# Altium schematic sheet optics.SchDoc
size A4
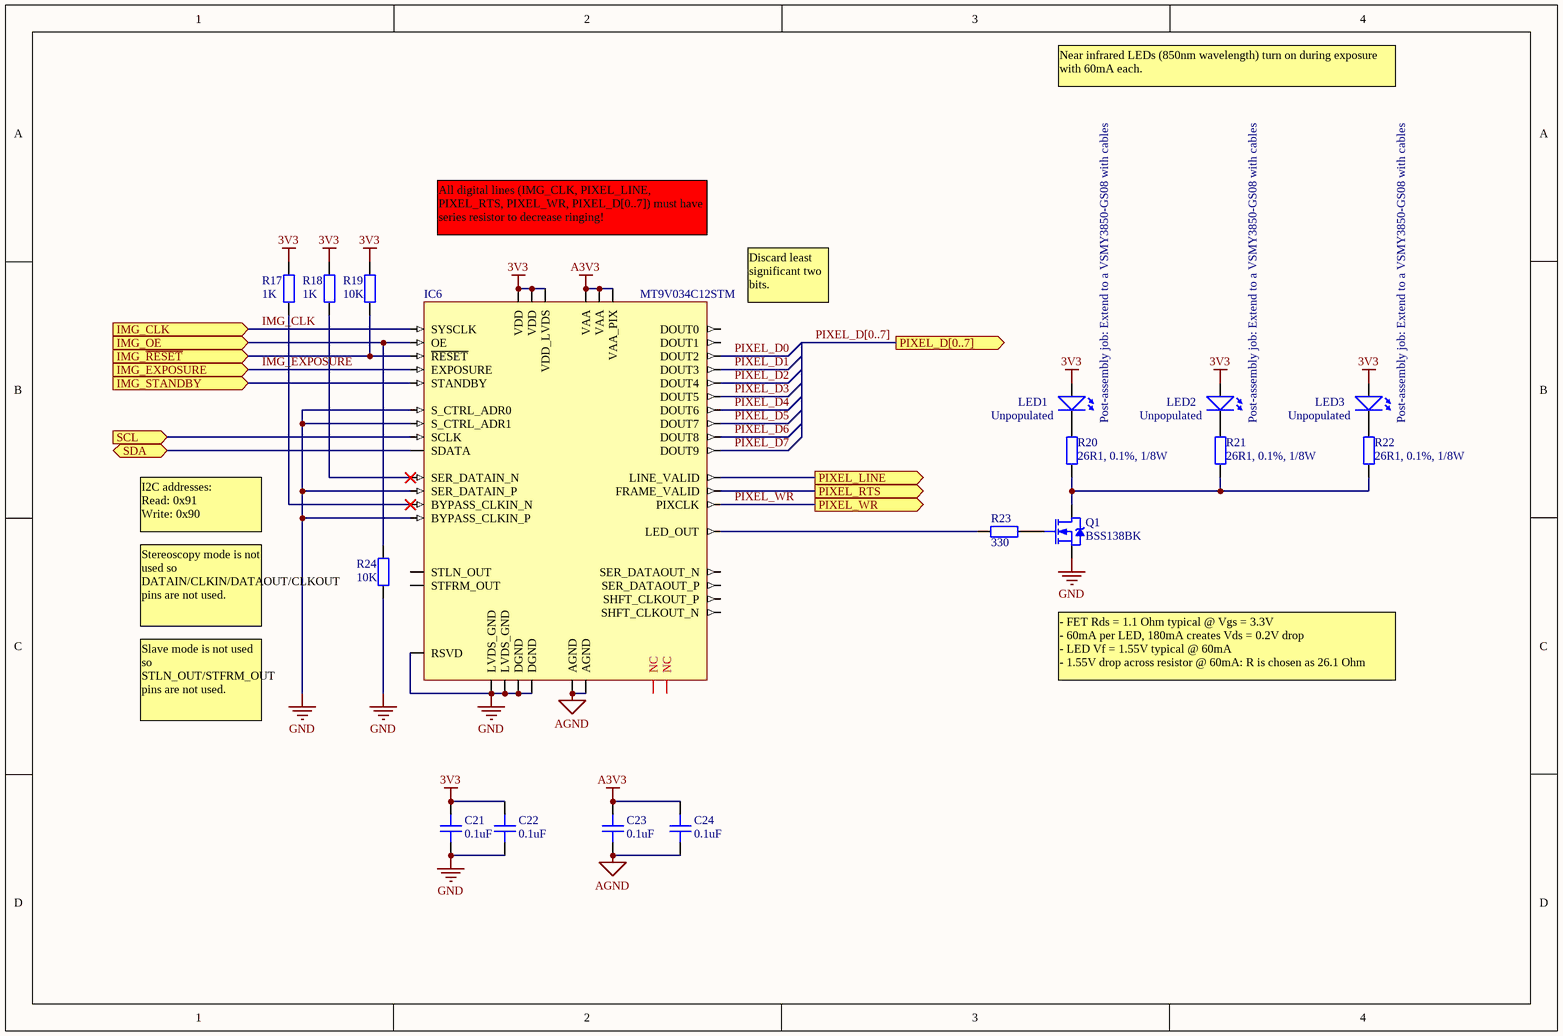
[diagram p0: optics.SchDoc]

## Parts
C21  0.1uF  [1608[0603]_M]
C22  0.1uF  [1608[0603]_M]
C23  0.1uF  [1608[0603]_M]
C24  0.1uF  [1608[0603]_M]
IC6  MT9V034C12STM  [CLCC-48_m]
LED1  Unpopulated  Post-assembly job: Extend to a VSMY3850-GS08 with cables  [PLCC2_WITH_HEATSINK]
LED2  Unpopulated  Post-assembly job: Extend to a VSMY3850-GS08 with cables  [PLCC2_WITH_HEATSINK]
LED3  Unpopulated  Post-assembly job: Extend to a VSMY3850-GS08 with cables  [PLCC2_WITH_HEATSINK]
Q1  BSS138BK  [SOT23-3_N]
R17  1K  [1608[0603]_M]
R18  1K  [1608[0603]_M]
R19  10K  [1608[0603]_M]
R20  26R1, 0.1%, 1/8W  [2012[0805]_M]
R21  26R1, 0.1%, 1/8W  [2012[0805]_M]
R22  26R1, 0.1%, 1/8W  [2012[0805]_M]
R23  330  [1608[0603]_M]
R24  10K  [1608[0603]_M]

## Ports
IMG_CLK (in), IMG_EXPOSURE (in), IMG_OE (in), IMG_STANDBY (in), IMG_~{RESET} (in), PIXEL_D[0..7] (out), PIXEL_LINE (out), PIXEL_RTS (out), PIXEL_WR (out), SCL (in), SDA (bidir)

## Nets
3V3: C21.2 C22.2 IC6.1(VDD) IC6.6(VDD_LVDS) IC6.14(VDD) LED1.A LED2.A LED3.A R17.2 R18.2 R19.2
A3V3: C23.2 C24.2 IC6.35(VAA) IC6.39(VAA) IC6.40(VAA_PIX)
AGND: C23.1 C24.1 IC6.34(AGND) IC6.38(AGND)
GND: C21.1 C22.1 IC6.7(LVDS_GND) IC6.9(BYPASS_CLKIN_P) IC6.11(SER_DATAIN_P) IC6.12(LVDS_GND) IC6.13(DGND) IC6.29(RSVD) IC6.30(S_CTRL_ADR0) IC6.31(S_CTRL_ADR1) IC6.48(DGND) Q1.S R24.1
IMG_CLK: IC6.47(SYSCLK) ; port IMG_CLK
IMG_EXPOSURE: IC6.23(EXPOSURE) ; port IMG_EXPOSURE
IMG_OE: IC6.28(OE) R24.2 ; port IMG_OE
IMG_~{RESET}: IC6.32(~{RESET}) R19.1 ; port IMG_~{RESET}
IMG_STANDBY: IC6.33(STANDBY) ; port IMG_STANDBY
PIXEL_D0: IC6.43(DOUT2)
PIXEL_D1: IC6.42(DOUT3)
PIXEL_D2: IC6.41(DOUT4)
PIXEL_D3: IC6.15(DOUT5)
PIXEL_D4: IC6.16(DOUT6)
PIXEL_D5: IC6.17(DOUT7)
PIXEL_D6: IC6.18(DOUT8)
PIXEL_D7: IC6.19(DOUT9)
PIXEL_LINE: IC6.20(LINE_VALID) ; port PIXEL_LINE
PIXEL_RTS: IC6.21(FRAME_VALID) ; port PIXEL_RTS
PIXEL_WR: IC6.46(PIXCLK) ; port PIXEL_WR
SCL: IC6.25(SCLK) ; port SCL
SDA: IC6.24(SDATA) ; port SDA
NetIC6_8: IC6.8(BYPASS_CLKIN_N) R17.1
NetIC6_10: IC6.10(SER_DATAIN_N) R18.1
NetIC6_27: IC6.27(LED_OUT) R23.1
NetLED1_K: LED1.K R20.2
NetLED2_K: LED2.K R21.2
NetLED3_K: LED3.K R22.2
NetQ1_D: Q1.D R20.1 R21.1 R22.1
NetQ1_G: Q1.G R23.2

Not connected (* = marked no-connect by the designer): IC6 2(SHFT_CLKOUT_N) 3(SHFT_CLKOUT_P) 4(SER_DATAOUT_P) 5(SER_DATAOUT_N) 22(STLN_OUT) 26(STFRM_OUT) 36(NC) 37(NC) 44(DOUT1) 45(DOUT0)

## Buses and harness runs
bus PIXEL_D[0..7] = port PIXEL_D[0..7]

## Notes on the sheet
- Near infrared LEDs (850nm wavelength) turn on during exposure with 60mA each.
- All digital lines (IMG_CLK, PIXEL_LINE, PIXEL_RTS, PIXEL_WR, PIXEL_D[0..7]) must have series resistor to decrease ringing!
- (near IC6) Discard least significant two bits.
- I2C addresses:
  Read: 0x91
  Write: 0x90
- Stereoscopy mode is not used so DATAIN/CLKIN/DATAOUT/CLKOUT pins are not used.
- Slave mode is not used so STLN_OUT/STFRM_OUT pins are not used.
- - FET Rds = 1.1 Ohm typical @ Vgs = 3.3V
  - 60mA per LED, 180mA creates Vds = 0.2V drop
  - LED Vf = 1.55V typical @ 60mA
  - 1.55V drop across resistor @ 60mA: R is chosen as 26.1 Ohm

## Library data of the parts
C21-C24 = Capacitor: Generic Capacitor; Value: 0.1uF
IC6 = MT9V034C12STM: 1/3" WVGA CMOS Image Sensor
LED1-LED3 = LED: Generic LED; pin to pad: A>1 K>2; Value: Unpopulated
Q1 = MOSFET-N_BodyDiode: N-channel MOSFET with body diode drawn; pin to pad: D>3 G>1 S>2
R17-R24 = Resistor: Generic Resistor
  R17 R18: Value: 1K
  R19 R24: Value: 10K
  R20-R22: Value: 26R1, 0.1%, 1/8W
  R23: Value: 330